# Altium schematic sheet Schematic.SchDoc
size A4; SheetNumber: 1; SheetTotal: 2
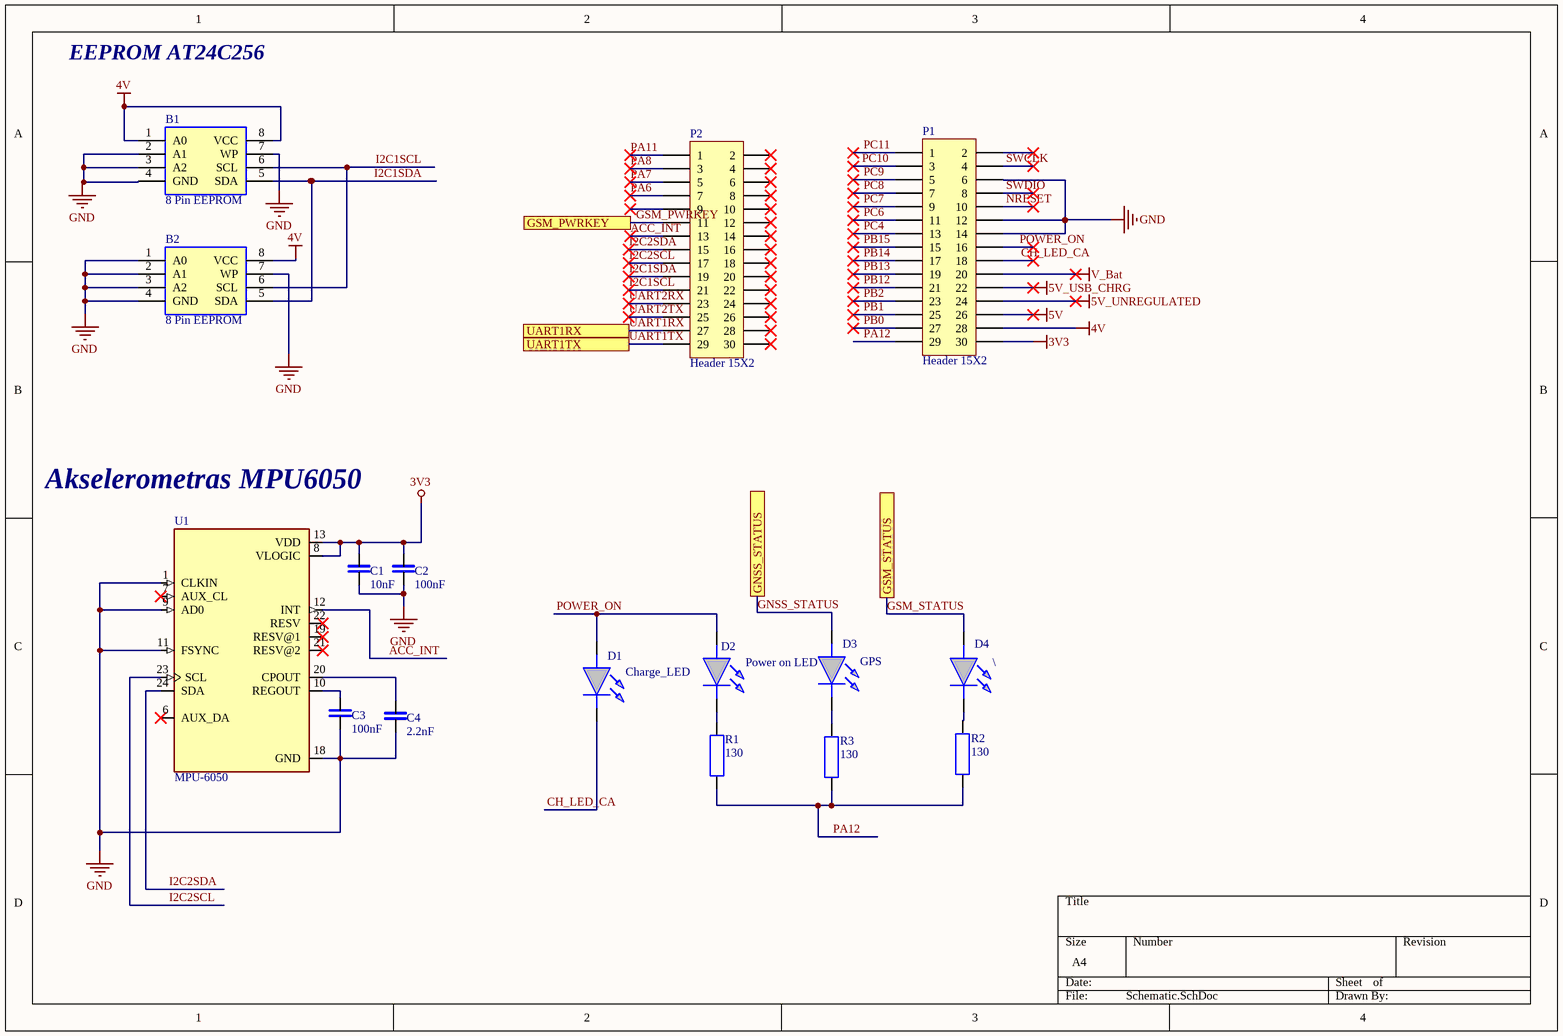
[diagram p0: Schematic.SchDoc]

## Parts
B1  8 Pin EEPROM  [AT24C256]
B2  8 Pin EEPROM  [AT24C256]
C1  10nF  [CAP_0805]
C2  100nF  [CAP_0805]
C3  100nF  [CAP_0805]
C4  2.2nF  [CAP_0805]
D1  Charge_LED  [LED_0805]
D2  Power on LED  [LED_0805]
D3  GPS  [LED_0805]
D4  \  [LED_0805]
P1  Header 15X2  [HDR2X15]
P2  Header 15X2  [HDR2X15]
R1  130  [RES_0805]
R2  130  [RES_0805]
R3  130  [RES_0805]
U1  MPU-6050  [MPU_6050]

## Ports
GNSS_STATUS, GSM_PWRKEY, GSM_STATUS, UART1RX, UART1TX

## Nets
3V3: C1.2 C2.2 P1.30 U1.8(VLOGIC) U1.13(VDD)
4V: B1.1(A0) B1.8(VCC) B2.8(VCC) P1.28
5V: P1.26
5V_UNREGULATED: P1.24
5V_USB_CHRG: P1.22
GND: B1.2(A1) B1.3(A2) B1.4(GND) B1.7(WP) B2.1(A0) B2.2(A1) B2.3(A2) B2.4(GND) B2.7(WP) C1.1 C2.1 C3.1 C4.1 P1.6 P1.12 P1.14 U1.1(CLKIN) U1.9(AD0) U1.11(FSYNC) U1.18(GND)
V_Bat: P1.20
ACC_INT: P2.13 U1.12(INT)
CH_LED_CA: D1.1(K) P1.18
GNSS_STATUS: D3.2(A) ; port GNSS_STATUS
GSM_PWRKEY: P2.11 ; port GSM_PWRKEY
GSM_STATUS: D4.2(A) ; port GSM_STATUS
I2C1SCL: B1.6(SCL) B2.6(SCL) P2.21
I2C1SDA: B1.5(SDA) B2.5(SDA) P2.19
I2C2SCL: P2.17 U1.23(SCL)
I2C2SDA: P2.15 U1.24(SDA)
NRESET: P1.10
PA6: P2.7
PA7: P2.5
PA8: P2.3
PA11: P2.1
PA12: P1.29 R1.1 R2.1 R3.1
PB0: P1.27
PB1: P1.25
PB2: P1.23
PB12: P1.21
PB13: P1.19
PB14: P1.17
PB15: P1.15
PC4: P1.13
PC6: P1.11
PC7: P1.9
PC8: P1.7
PC9: P1.5
PC10: P1.3
PC11: P1.1
POWER_ON: D1.2(A) D2.2(A) P1.16
SWCLK: P1.4
SWDIO: P1.8
UART1RX: P2.27 ; port UART1RX
UART1TX: P2.29 ; port UART1TX
UART2RX: P2.23
UART2TX: P2.25
NetC3_2: C3.2 U1.10(REGOUT)
NetC4_2: C4.2 U1.20(CPOUT)
NetD2_1: D2.1(K) R1.2
NetD3_1: D3.1(K) R3.2
NetD4_1: D4.1(K) R2.2

Not connected (* = marked no-connect by the designer): P1 2*; P2 2* 4* 6* 8* 9* 10* 12* 14* 16* 18* 20* 22* 24* 26* 28* 30*; U1 6(AUX_DA)* 7(AUX_CL)* 19(RESV@1)* 21(RESV@2)* 22(RESV)*

## Notes on the sheet
- EEPROM AT24C256
- Akselerometras MPU6050

## Library data of the parts
B1 B2 = AT24C256C: EEPROM 256K (32K X 8), 2-WI 1.8V / https://lt.farnell.com/microchip/at24c256c-sshl-t/serial-eeprom-256kbit-1mhz-soic/dp/2345588?st=AT24C256|; Geometry.Height: 1.75mm; Manufacturer_Name: Microchip; Manufacturer_Part_Number: AT24C256C-SSHL-T; Mouser Part Number: 556-AT24C256C-SSHL-T; Mouser Price/Stock: https://www.mouser.co.uk/ProductDetail/Microchip-Technology/AT24C256C-SSHL-T?qs=fzsaQExJLyR3ptk4tHE3tA%3D%3D; Arrow Part Number: AT24C256C-SSHL-T; Arrow Price/Stock: https://www.arrow.com/en/products/at24c256c-sshl-t/microchip-technology?region=nac; Datasheet Link: http://www.atmel.com/Images/Atmel-8568-SEEPROM-AT24C256C-Datasheet.pdf
C1-C4 = SMT_CAP: MP: LD051A270KAB2A; Package: None; Price: None; Availability: Unavailable
D1-D4 = LED: PART: MULTICOMP PRO MP008291LED / https://lt.farnell.com/multicomp-pro/mp008291/led-green-70mcd-576nm-0805/dp/3796323?st=smt%20led; Manufacturer_Name: Avago Technologies; Manufacturer_Part_Number: HSMH-C170; Geometry.Height: 0.9mm; Mouser Part Number: 630-HSMH-C170; Mouser Price/Stock: https://www.mouser.co.uk/ProductDetail/Broadcom-Avago/HSMH-C170?qs=YDL0qNrpDT6b21G9HrN9ig%3D%3D; Arrow Part Number: *; Arrow Price/Stock: *; Datasheet Link: https://docs.broadcom.com/docs/AV02-0551EN
P1 P2 = Header 15X2: Header, 15-Pin, Dual row; LatestRevisionDate: 17-Jul-2002; LatestRevisionNote: Re-released for DXP Platform.; Publisher: Altium Limited
R1-R3 = SMT_RES: Power_Rating: .25 W; MP: 2-2176053-0; Tolerance: 1%; Resistance: .33; MF: TE Connectivity; Price: None; Availability: In Stock; EU_RoHS_Compliance: Compliant with Exemptions; Package: 0805; Value: *; SnapEDA_Link: https://www.snapeda.com/parts/2-2176053-0/TE+Connectivity/view-part/?ref=snap; Check_prices: https://www.snapeda.com/parts/2-2176053-0/TE+Connectivity/view-part/?ref=eda
U1 = MPU-6050: MPU-6050 series Accelerometer, Gyroscope, 3 Axis Sensor Evaluation Board / https://lt.farnell.com/invensense/mpu-6050/gyro-accel-6-axis-i2c-qfn-24/dp/1864742; MF: TDK InvenSense; Value: *; SnapEDA_Link: https://www.snapeda.com/parts/MPU-6050/TDK+InvenSense/view-part/?ref=snap; Purchase-URL: https://pricing.snapeda.com/search/part/MPU-6050/?ref=eda; Availability: In Stock; Price: None; Package: QFN-24 InvenSense; Check_prices: https://www.snapeda.com/parts/MPU-6050/TDK+InvenSense/view-part/?ref=eda; MP: MPU-6050